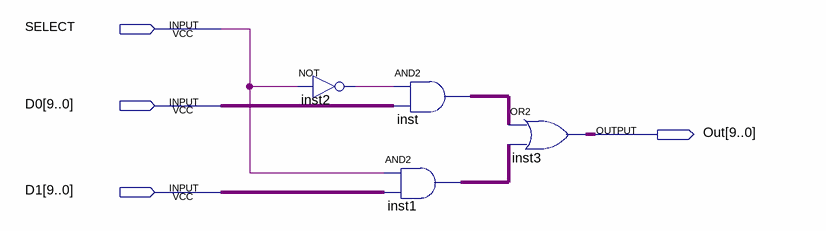
[diagram p0: schematic sheet]
// Quartus schematic MUX2to1.bdf as structural Verilog: 4 symbols, 4 pins
module MUX2to1 (
  input  SELECT,
  input  [9:0] D0,
  input  [9:0] D1,
  output [9:0] Out
);

  wire inst2_out;
  wire [9:0] inst1_out, inst_out;

  not inst2 (inst2_out, SELECT);
  assign inst_out = {10{inst2_out}} & D0;  // AND2 inst, 10 bits wide
  assign inst1_out = {10{SELECT}} & D1;  // AND2 inst1, 10 bits wide
  assign Out = inst_out | inst1_out;  // OR2 inst3, 10 bits wide
endmodule
